# EAGLE design DS2408_2PIO_6S_v2 (EAGLE 7.4.0)
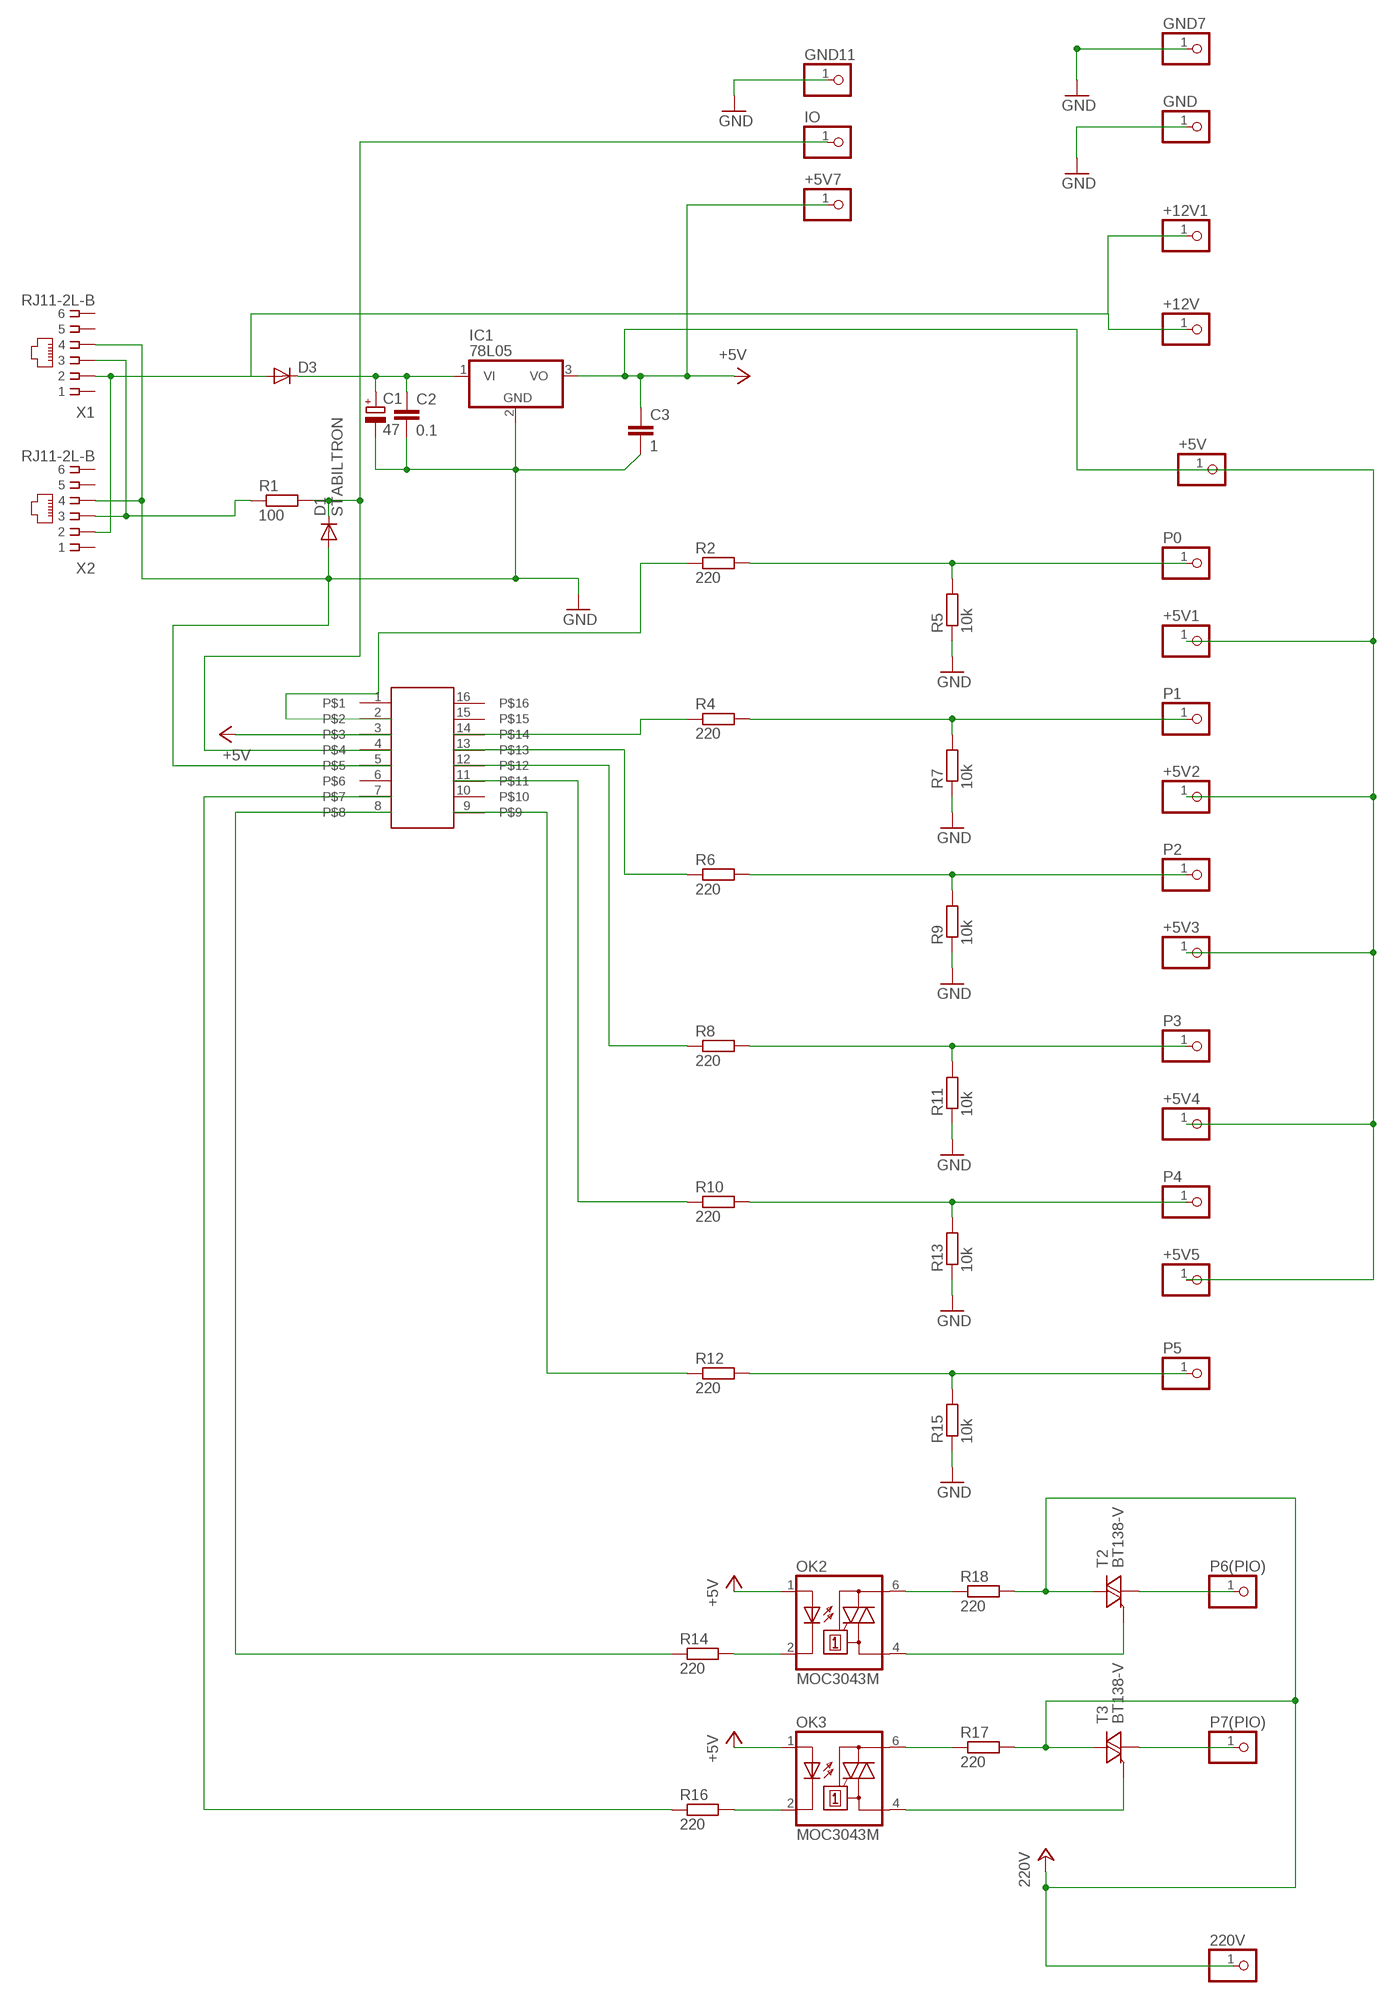
[diagram p0: schematic, sheet 1]

## Parts
220V  PINHD-1X1  [1X01]
+5V  PINHD-1X1  [1X01]
+5V1  PINHD-1X1  [1X01]
+5V2  PINHD-1X1  [1X01]
+5V3  PINHD-1X1  [1X01]
+5V4  PINHD-1X1  [1X01]
+5V5  PINHD-1X1  [1X01]
+5V7  PINHD-1X1  [1X01]
+12V  PINHD-1X1  [1X01]
+12V1  PINHD-1X1  [1X01]
C1  47  CPOL-EUE5-10.5  [E5-10,5]
C2  0.1  C-EUC1206  [C1206]
C3  1  C-EUC1206  [C1206]
D1  STABILTRON  1N4148DO35-10  [DO35-10]
D3  DIODE-MINIMELF  [MINIMELF]
GND  PINHD-1X1  [1X01]
GND7  PINHD-1X1  [1X01]
GND11  PINHD-1X1  [1X01]
IC1  78L05  7805TV  [TO220V]
IO  PINHD-1X1  [1X01]
OK2  MOC3043M  [DIL06]
OK3  MOC3043M  [DIL06]
P0  PINHD-1X1  [1X01]
P1  PINHD-1X1  [1X01]
P2  PINHD-1X1  [1X01]
P3  PINHD-1X1  [1X01]
P4  PINHD-1X1  [1X01]
P5  PINHD-1X1  [1X01]
P6(PIO)  PINHD-1X1  [1X01]
P7(PIO)  PINHD-1X1  [1X01]
R1  100  R-EU_M1206  [M1206]
R2  220  R-EU_M1206  [M1206]
R4  220  R-EU_M1206  [M1206]
R5  10k  R-EU_M1206  [M1206]
R6  220  R-EU_M1206  [M1206]
R7  10k  R-EU_M1206  [M1206]
R8  220  R-EU_M1206  [M1206]
R9  10k  R-EU_M1206  [M1206]
R10  220  R-EU_M1206  [M1206]
R11  10k  R-EU_M1206  [M1206]
R12  220  R-EU_M1206  [M1206]
R13  10k  R-EU_M1206  [M1206]
R14  220  R-EU_M1206  [M1206]
R15  10k  R-EU_M1206  [M1206]
R16  220  R-EU_M1206  [M1206]
R17  220  R-EU_M1206  [M1206]
R18  220  R-EU_M1206  [M1206]
T2  BT138-V  [TO220BV]
T3  BT138-V  [TO220BV]
U$1  DS2408S  [SO16]
X1  RJ11-2L-B  [RJ11-NO_SHIELD]
X2  RJ11-2L-B  [RJ11-NO_SHIELD]

## Nets
200V: 220V.1 R17.2 R18.2 T2.T2(A2) T3.T2(A2) ; supply symbol labelled 220V
+5V: +5V1.1 +5V2.1 +5V3.1 +5V4.1 +5V5.1 +5V7.1 +5V.1 C3.1 IC1.3(VO) OK2.1(A) OK3.1(A) U$1.3
GND: C1.- C2.2 C3.2 D1.A GND7.1 GND11.1 GND.1 IC1.2(GND) R5.1 R7.1 R9.1 R11.1 R13.1 R15.1 U$1.5 X1.4 X2.4
N$1: +12V1.1 +12V.1 D3.A X1.2 X2.2
N$2: R1.1 X1.3 X2.3
N$3: P1.1 R4.2 R7.2
N$4: R4.1 U$1.14
N$5: R14.1 U$1.8
N$6: OK3.2(C) R16.2
N$7: D1.C IO.1 R1.2 U$1.4
N$8: P0.1 R2.2 R5.2
N$9: P2.1 R6.2 R9.2
N$11: OK2.2(C) R14.2
N$12: R12.1 U$1.9
N$13: P3.1 R8.2 R11.2
N$14: OK2.6(A2) R18.1
N$15: OK3.6(A2) R17.1
N$16: P4.1 R10.2 R13.2
N$17: P5.1 R12.2 R15.2
N$19: R6.1 U$1.13
N$20: C1.+ C2.1 D3.C IC1.1(VI)
N$23: OK2.4(A1) T2.G
N$24: OK3.4(A1) T3.G
N$25: R8.1 U$1.12
N$28: P6(PIO).1 T2.T1(A1)
N$29: P7(PIO).1 T3.T1(A1)
N$30: R10.1 U$1.11
N$40: R16.1 U$1.7
N$46: R2.1 U$1.2
Unconnected: U$1.1 U$1.6 U$1.10 U$1.15 U$1.16 X1.1 X1.5 X1.6 X2.1 X2.5 X2.6

## Library data of the parts
220V +5V +5V1-+5V5 +5V7 +12V +12V1 GND GND7 GND11 IO P0 P1-P5 P6(PIO) P7(PIO) = pinhead:PINHD-1X1: PIN HEADER
C1 = rcl:CPOL-EU: POLARIZED CAPACITOR, European symbol
C2 C3 = rcl:C-EU: CAPACITOR, European symbol
D1 = diode:1N4148: DIODE high speed (Philips)
D3 = diode:DIODE-: DIODE
IC1 = linear:78*: Positive VOLTAGE REGULATOR Source: http://cache.national.com/ds/LM/LM78L05.pdf http://www.fairchildsemi.com/ds/LM/LM7805.pdf
OK2 OK3 = optocoupler:MOC30*: 6-Pin DIP Zero-Cross Optoisolators Triac Driver Output (250/400 Volt Peak) Source: http://www.fairchildsemi.com/ds/MO/MOC3043-M.pdf; MF: FAIRCHILD SEMICONDUCTOR; MPN: MOC3043-M; OC_FARNELL: 1021371; OC_NEWARK: 72K8900
R1 R2 R4-R18 = rcl:R-EU_: RESISTOR, European symbol
T2 T3 = triac:BT138: TRIAC Source: http://www.semiconductors.philips.com BT138_SERIES_2.pdf
U$1 = barsmonster:DS2408S
X1 X2 = con-tycoelectronics:RJ11: CORCOM Modular RJ Jacks No Shield Source: www.tycoelectronics.com .. ENG_DS_1654001_1099_RJ_L_0507.pdf; MF: TYCO ELECTRONICS; MPN: RJ11-2L-B; OC_FARNELL: unknown; OC_NEWARK: 83F4463

## Board
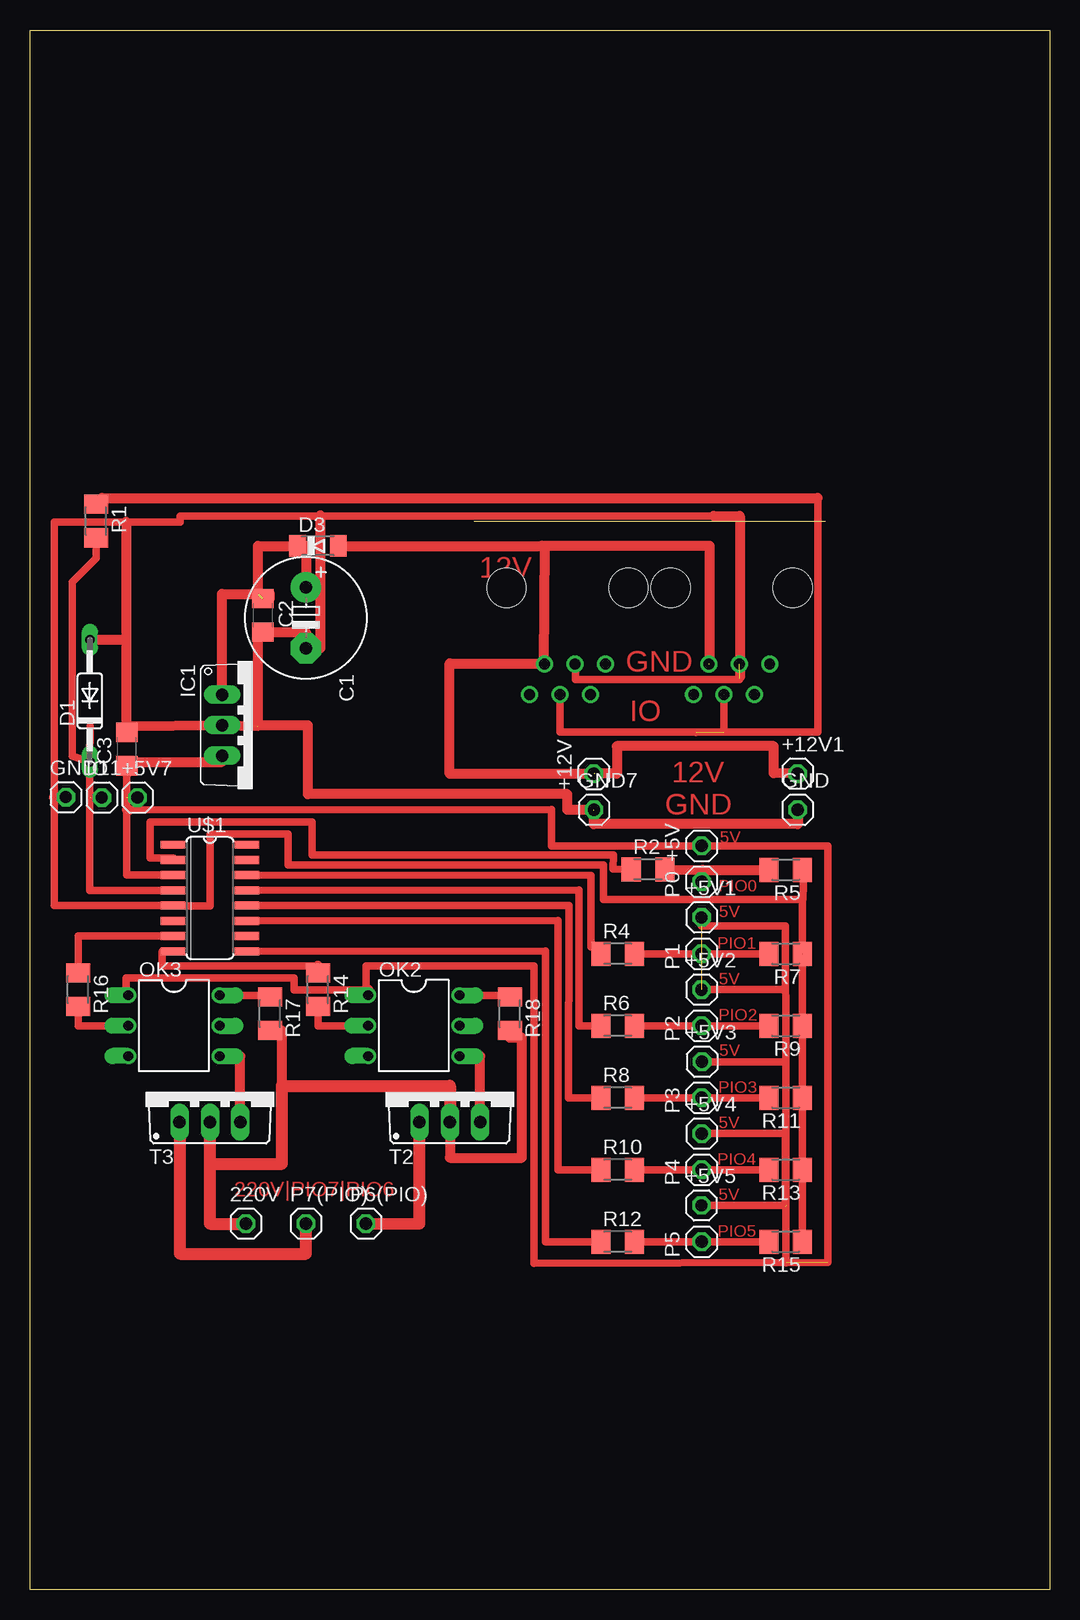
[diagram p1: board, top side]
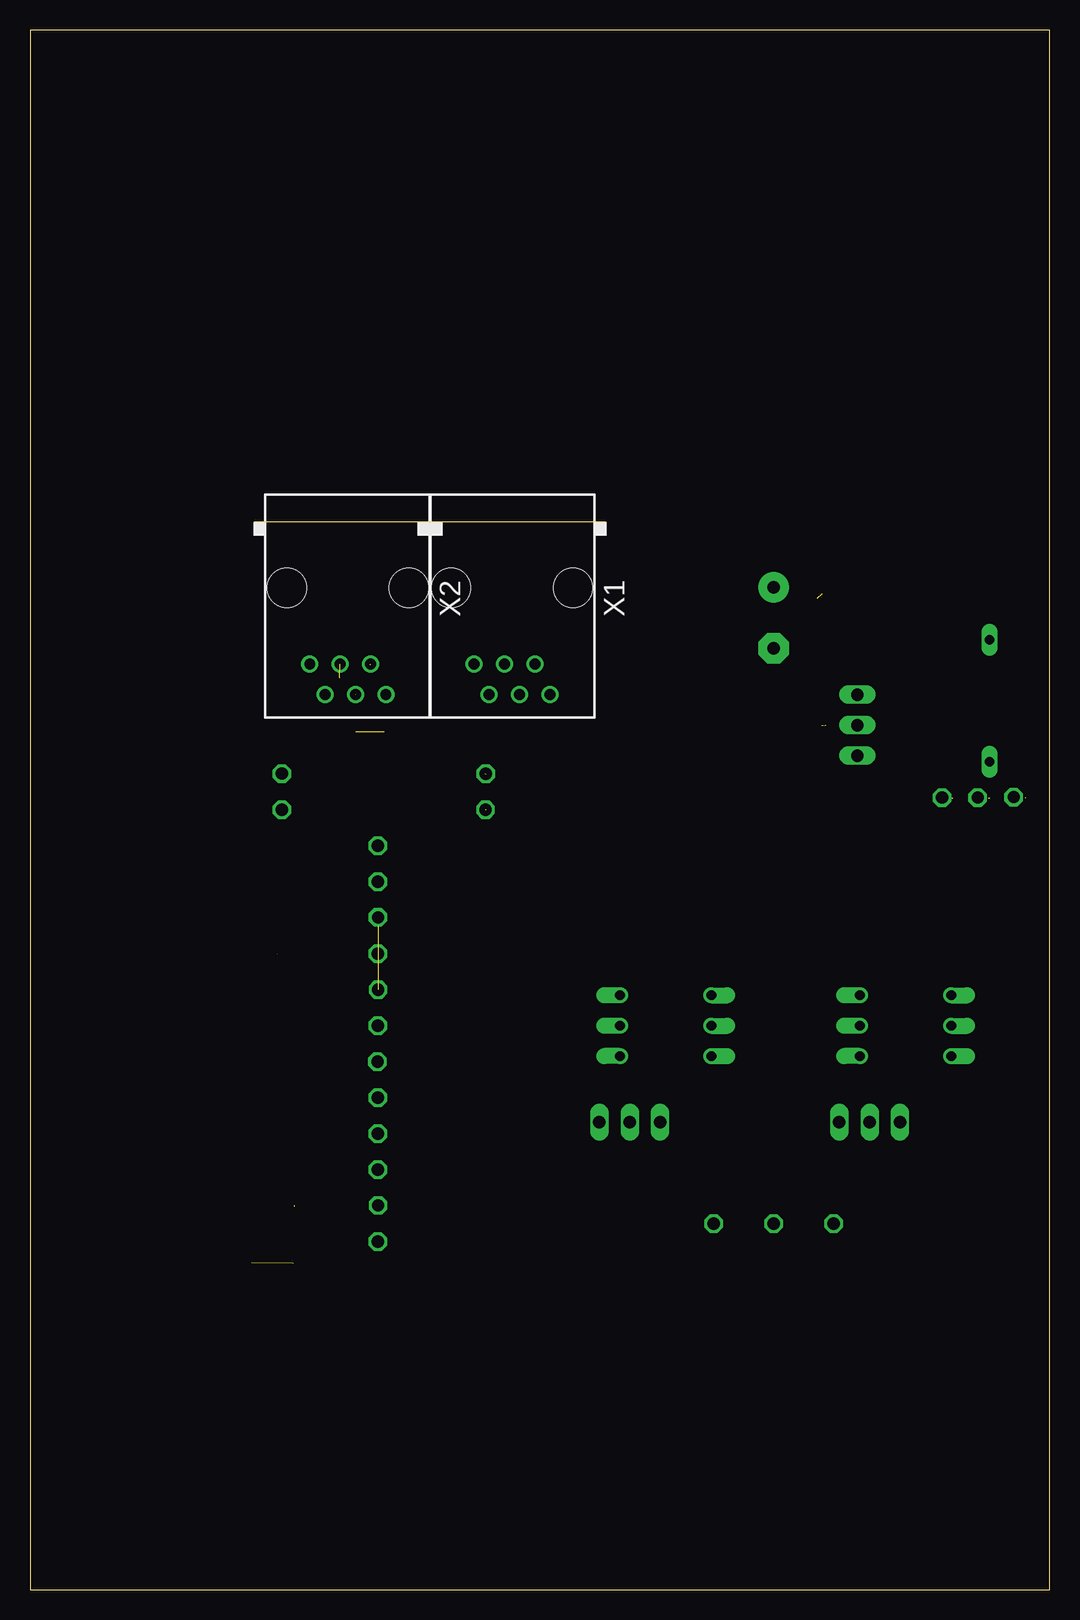
[diagram p2: board, bottom side, seen from below]

Size 85 x 130 mm. Coordinates in mm from the lower left corner, seen from the top.
Outline: 85,0 0,0 0,130 85,130 85,0
Copper layers (1*16): Top 0.035mm / dielectric 1.5mm / Bottom 0.035mm
Design rules "default": minimum track width 10mil, minimum drill 24mil, track to track 8mil, track to pad 8mil, pad to pad 8mil, via to via 8mil, smd to smd 8mil, copper to edge 40mil, drill to drill 8mil, minimum pad ring 10mil, minimum via ring 8mil, stop-mask expansion 4mil, vias tented up to drill 0mil, thermal gap 10mil

### Footprints (pad centres in the part's own frame; a part is rotated, then mirrored left to right if it is on the bottom)
1X01 = drill 1.016 octagon: 1 0,0
E5-10,5 = drill 1.016 pad 2.54: + -2.54,0 | drill 1.016 pad 2.54 octagon: - 2.54,0
C1206 = smd 1.6 x 1.8: 1 -1.4,0; 2 1.4,0
DO35-10 = drill 0.813 long: A 5.08,0; C -5.08,0
MINIMELF = smd 1.4 x 1.8: A 1.7,0; C -1.7,0
TO220V = drill 1.016 long: 1 -2.54,-2.54; 2 0,-2.54; 3 2.54,-2.54
DIL06 = drill 0.813 offset: 1 -2.54,-3.81; 2 0,-3.81; 3 2.54,-3.81; 4 2.54,3.81; 5 0,3.81; 6 -2.54,3.81
M1206 = smd 1.6 x 2: 1 -1.4,0; 2 1.4,0
TO220BV = drill 1.016 long: G 2.54,-2.54; T1 -2.54,-2.54; T2 0,-2.54
SO16 = smd 0.66 x 2.032: 1 -4.445,-3.073; 2 -3.175,-3.073; 3 -1.905,-3.073; 4 -0.635,-3.073; 5 0.635,-3.073; 6 1.905,-3.073; 7 3.175,-3.073; 8 4.445,-3.073; 9 4.445,3.073; 10 3.175,3.073; 11 1.905,3.073; 12 0.635,3.073; 13 -0.635,3.073; 14 -1.905,3.073; 15 -3.175,3.073; 16 -4.445,3.073
RJ11-NO_SHIELD = drill 0.9 pad 1.4: 1 -3.175,8.89; 2 -1.905,6.35; 3 -0.635,8.89; 4 0.635,6.35; 5 1.905,8.89; 6 3.175,6.35 | hole 3.251: -5.08,0; 5.08,0

### Placement (x,y rotation side)
220V  18,30.5 0 top
+5V  56,62 90 top
+5V1  55.99,56.03 0 top
+5V2  55.98,50 0 top
+5V3  56.03,44 0 top
+5V4  56,38.01 0 top
+5V5  55.98,32.02 0 top
+5V7  8.96,66.01 0 top
+12V  47,68 90 top
+12V1  64.01,68.01 0 top
C1  [E5-10,5]  23,81 270 top
C2  [C1206]  19.41,81.21 270 top
C3  [C1206]  8.08,70.06 90 top
D1  4.99,74.08 90 top
D3  24,87 0 top
GND  64,64.99 0 top
GND7  47.02,64.99 0 top
GND11  2.99,66.05 0 top
IC1  18.56,72.05 270 top
IO  5.99,66.01 0 top
OK2  32,47 270 top
OK3  12,47 270 top
P0  56,59 90 top
P1  56,53 90 top
P2  56,47 90 top
P3  56,41 90 top
P4  56,35 90 top
P5  56,29 90 top
P6(PIO)  28,30.5 0 top
P7(PIO)  23,30.5 0 top
R1  5.5,89.07 270 top
R2  51.53,60.03 0 top
R4  49,53 0 top
R5  63,60 180 top
R6  49,47 0 top
R7  63,53 180 top
R8  49,41 0 top
R9  63,47 180 top
R10  49,35 0 top
R11  63,41 180 top
R12  49,29 0 top
R13  63,35 180 top
R14  24,50 270 top
R15  63,29 180 top
R16  4,50 270 top
R17  20,48 270 top
R18  40,48 270 top
T2  35,41.5 0 top
T3  15,41.5 0 top
U$1  15,57.64 270 top
X1  44.81,83.5 180 bottom
X2  58.5,83.5 180 bottom

### Tracks (layer width: path | path; a pad name or v marks a point on that pad's centre or on a via)
200V
  Top 0.813: 15,35.5 T3.T2 15,39.5 | R17.2 21,46.6 21,42 | T2.T2 35,36 41,36 41,46 40,46 R18.2
  Top 1.016: T2.T2 35,42 21,42 21,35.5 15,35.5 | 220V.1 15,30.5 T3.T2
+5V  (4 unrouted)
  Top 0.61: U$1.3 8.08,59.55 8.08,65 | 8.08,65 8.08,68 C3.1 | 8.08,65 43.46,65.02 43.46,62 +5V.1 66.5,62 66.51,27.27 42.02,27.18 42,52 28,52 28,50 22,50 22,51 8,51 8,49.54 OK3.1 | +5V5.1 63,32.02 63,27.25 63.08,27.25 63.08,27.24 | +5V4.1 62.96,38.01 62.96,31.93 63.01,31.93 63.01,44 | 63.01,44 62.98,55.33 56.03,55.33 56.03,55.3 55.98,55.3 +5V1.1 | +5V3.1 63.01,44 | +5V2.1 62.96,50 62.96,49.96
  Top 0.813: IC1.3 16,69 8.08,69 8.08,68 | 28,50 28.19,50 OK2.1 | 8.08,65 8.23,65 8.23,64.96 | +5V7.1 8.15,66.01 8.15,66
GND  (6 unrouted)
  Top 0.61: 57,89.5 12.5,89.5 12.5,89 8,89 2,89 2,57.01 U$1.5 15,57 15,63 21.5,63 21.5,60.41 47.81,60.4 47.81,57.52 58.5,57.52 58.43,57.52 64.39,57.52 | C3.2 8.08,72 | R15.1 R13.1 R11.1 R9.1 R7.1 | R5.1 64.5,60 64.43,57.52 64.39,57.52 | X1.4 45.46,77.15 45.46,75.85 59.13,75.85 59.13,75.98 | 64.39,57.52 R7.1
  Top 0.813: 8.08,72 IC1.2 19,72 19,79.81 C2.2 23,79.81 C1.- 24.22,78.46 24.22,89.54 | C3.2 8,71.46 8,79.16 | 8,89 8,79.16 | 8,79.16 D1.A | 57,89.5 59.17,89.5 59.17,76.02 | GND7.1 44.8,64.99 44.8,66.3 23.18,66.3 23.18,72.03 18.66,72.03 18.66,71.99 | GND.1 64.02,63.81 47.02,63.81 46.99,64.99 | GND11.1 2.02,66.05 2.02,66.03
N$1  (2 unrouted)
  Top 0.813: D3.A 42.88,87 | 42.88,87 42.83,77.2 | 42.88,87 42.63,87 56.65,87 56.65,77.11 | +12V.1 34.99,68 34.99,77.2 42.83,77.2 | 42.83,77.2 42.69,77.17 | X1.2 42.69,77.17 | 42.69,77.17 42.63,77.11 | +12V1.1 62.01,68.06 62.01,70.3 48.92,70.3 48.92,68.01 47.06,68.01 47.06,68.04
N$2  (2 unrouted)
  Top 0.61: R1.1 5.5,91 | 65.68,91 65.68,71.47 55.5,71.47 55.5,71.42 | X1.3 44.18,71.47 57.87,71.47 57.87,74.59 | X2.3 57.86,74.66 57.83,74.66 57.83,74.56
  Top 0.813: R1.1 6,90.47 6,91 65.68,91
N$3
  Top 0.61: R4.2 P1.1 R7.2
N$4
  Top 0.61: U$1.14 46.75,59.53 46.75,53.55 47.05,53.55 R4.1
N$5
  Top 0.61: U$1.8 11,53.2 11,52 24,52
  Top 0.813: 24,52 R14.1
N$6
  Top 0.61: R16.2 4,47 OK3.2
N$7  (1 unrouted)
  Top 0.61: D1.C 5,71.99 | R1.2 5.5,86 3.5,84 3.5,69.49 D1.C | U$1.4 4.99,58.27 D1.C
  Top 0.813: IO.1 5.11,66.01 5.11,66
N$8
  Top 0.813: R2.2 56.09,60 | 56.09,60 P0.1 | 56.09,60 R5.2
N$9
  Top 0.61: R6.2 P2.1 R9.2
N$11
  Top 0.61: R14.2 24,47 28,47
  Top 0.813: 28,47 OK2.2
N$12
  Top 0.61: U$1.9 42.97,53.23 42.99,28.99 R12.1
N$13
  Top 0.61: R8.2 P3.1 R11.2
N$14
  Top 0.61: OK2.6 40,49.54 R18.1
N$15
  Top 0.61: OK3.6 20,49.54 R17.1
N$16
  Top 0.61: R10.2 P4.1 R13.2
N$17
  Top 0.61: R12.2 P5.1 | P5.1 61,29 | P5.1 R15.2
N$19
  Top 0.61: U$1.13 45.78,58.31 45.79,46.99 R6.1
N$20  (1 unrouted)
  Top 0.813: IC1.1 16,83 19,83 19,87 D3.C 23,87 C1.+ | C2.1 20,82.61 20,83
N$23
  Top 0.813: OK2.4 37.54,44.46 T2.G
N$24
  Top 0.813: OK3.4 17.54,44.46 T3.G
N$25
  Top 0.61: U$1.12 44.93,57.03 44.89,40.97 R8.1
N$28
  Top 0.813: 32.46,39 T2.T1
  Top 1.016: P6(PIO).1 32.46,30.51 32.46,39
N$29
  Top 0.813: 12.5,38.96 T3.T1
  Top 1.016: P7(PIO).1 23,28 12.5,28 12.5,38.96
N$30
  Top 0.61: U$1.11 44.04,55.76 44,35 R10.1
N$40
  Top 0.61: U$1.7 4,54.47 R16.1
N$46
  Top 0.61: R2.1 48.62,60.05 48.65,61.22 23.5,61.22 23.5,64 10,64 10,61 11.93,61 U$1.2

### Text on the board
Top: 12V | GND | IO | 12V | GND | 5V | PIO0 | 5V | PIO1 | 5V | PIO2 | 5V | PIO3 | 5V | PIO4 | 220V|PIO7|PIO6 | 5V | PIO5